# EasyEDA Pro project filmprocessor.epro

# Schematic github.com/wojas/filmprocessor
Board Name: Board1; Create Date: 2025-09-29; Page Name: P1; Project Name: Film Processor; Schematic Name: github.com/wojas/filmprocessor; Update Date: 2025-10-02; Page Size: A4; Version: V1.0
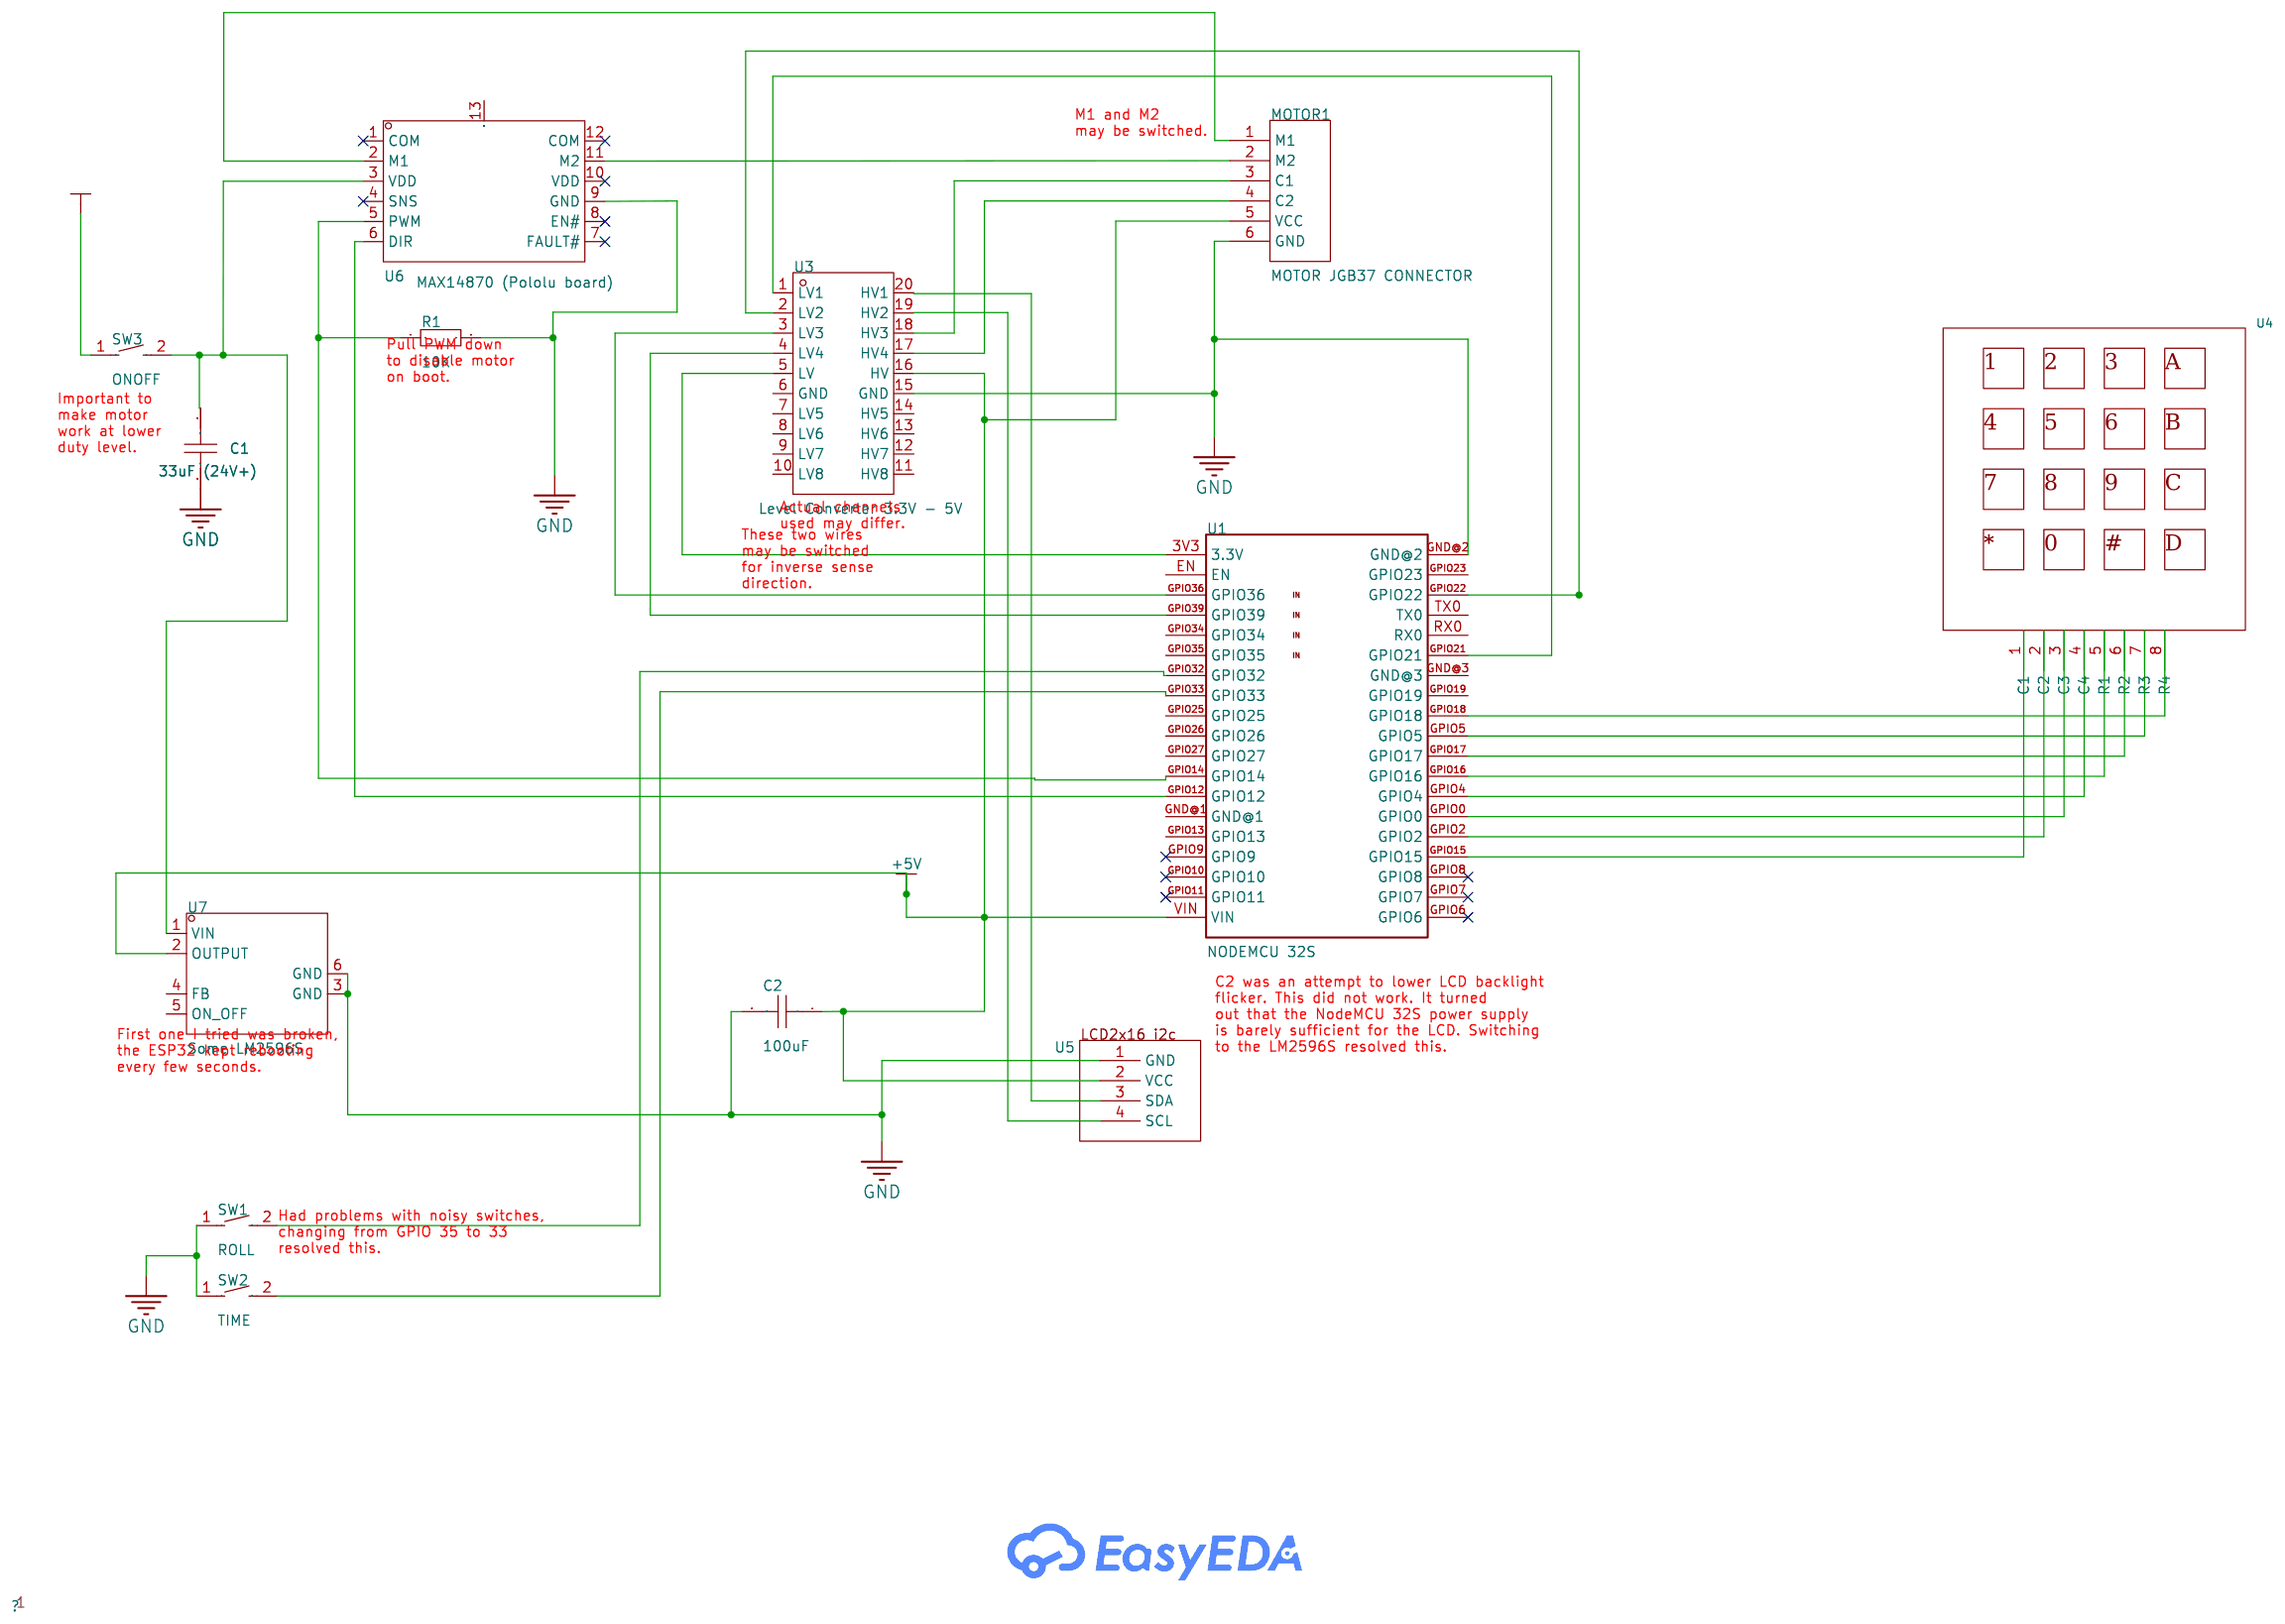
[diagram p0: schematic sheet]

## Parts
C1  33uF (24V+)  [C0603]
C2  100uF  [C0603]
MOTOR1  MOTOR JGB37 CONNECTOR
R1  10K  [R0603]
SW1  ROLL  [KEY-SMD_L6.0-W3.5-LS8.0]
SW2  TIME  [KEY-SMD_L6.0-W3.5-LS8.0]
SW3  ONOFF  [KEY-SMD_L6.0-W3.5-LS8.0]
U1  NODEMCU32S  [footprints:NODEMCU32S]
U3  Level Converter 3.3V - 5V  [MPN-TH-20_L28.0-W14.0-P2.54-BL]
U4  -
U5  -
U6  MAX14870 (Pololu board)  [DFN-12_L3.0-W3.0-P0.50-LS3.0-BL-EP]
U7  Some LM2596S  [TO-263-5_L10.4-W8.6-P1.70-LS15.3-BR]

## Library data of the parts
C1 C2 = CAP_0603: Supplier Footprint: 0603
MOTOR1 = MOTOR JGB37 CONNECTOR: Supplier Part: MOTOR JGB37-520
R1 = Res_0603: Supplier Footprint: 0603
SW1-SW3 = BUTTON2,KEY: Supplier Part: C9900020455; JLCPCB Part Class: Extended Part; Supplier: LCSC
U1 = NODEMCU32S_NODEMCU32S: Users: D27; availability: Not in stock; check_prices: https://www.snapeda.com/parts/NODEMCU-32S/AI-Thinker/view-part/?ref=eda; mf: AI-Thinker; mp: NODEMCU-32S; Package1: Package; price: None; snapeda_link: https://www.snapeda.com/parts/NODEMCU-32S/AI-Thinker/view-part/?ref=snap
U3 = Level Converter 8: Supplier Part: C2829587; Supplier Footprint: DIP-20; JLCPCB Part Class: Extended Part; Supplier: LCSC
U4 = keypad
U5 = lcd_2x16 with i2c module
U6 = MAX14870ETC+T: LCSC Part Name: 3A 有刷直流电机驱动芯片 36V; Supplier Part: C194048; Manufacturer: ADI(亚德诺)/MAXIM(美信); Supplier Footprint: DFN-12(3x3); JLCPCB Part Class: Extended Part; Datasheet: https://atta.szlcsc.com/upload/public/pdf/source/20180625/C194048_CE7F1CC1EFE295F679622D2E942E3352.pdf; Supplier: LCSC
U7 = LM2596S-ADJ_C3198435: Function:Step-down type Output Type:Adjustable Input Voltage:4.5V~40V Input Voltage:4.5V~40V Output Voltage:1.2V~37V Output Voltage:1.2V~37V Output Current:3A Switching Frequency:150kHz Switching Frequency:150kHz Operating Temperature:-40℃~+125℃@(TJ) Oper; LCSC Part Name: LM2596S-ADJ; Supplier Part: C3198435; Supplier Footprint: TO-263-5; Datasheet: https://atta.szlcsc.com/upload/public/pdf/source/20230921/2B96ED50C3BF1924A72365F91F431302.pdf; Supplier: LCSC; Function: Step-down type; Output Type: Adjustable; Input Voltage: 4.5V~40V; Output Voltage: 1.2V~37V; Output Current: 3A; Switching Frequency: 150kHz; Operating Temperature: -40℃~+125℃@(TJ); Synchronous Rectification: No; Number of Outputs: 1; Topology: Step-down; Switch tube (built-in/external): Built-in

## Nets
+5V: C2.1 MOTOR1.5(VCC) U1.VIN U3.16(HV) U5.2(VCC) U7.2(OUTPUT)
+24V: SW3.1
GND: C1.2 C2.2 MOTOR1.6(GND) R1.2 SW1.1 SW2.1 U1.GND@2 U3.15(GND) U5.1(GND) U6.9(GND) U7.3(GND) U7.6(GND)
Net-(C1-1): C1.1 SW3.2 U6.3(VDD) U7.1(VIN)
Net-(MOTOR1-1): MOTOR1.1(M1) U6.2(M1)
Net-(MOTOR1-2): MOTOR1.2(M2) U6.11(M2)
Net-(MOTOR1-3): MOTOR1.3(C1) U3.18(HV3)
Net-(MOTOR1-4): MOTOR1.4(C2) U3.17(HV4)
Net-(R1-1): R1.1 U1.GPIO14 U6.5(PWM)
Net-(SW1-2): SW1.2 U1.GPIO32
Net-(SW2-2): SW2.2 U1.GPIO33
Net-(U1-3V3): U1.3V3(3.3V) U3.5(LV)
Net-(U1-GPIO0): U1.GPIO0 U4.3(C3)
Net-(U1-GPIO2): U1.GPIO2 U4.2(C2)
Net-(U1-GPIO4): U1.GPIO4 U4.4(C4)
Net-(U1-GPIO5): U1.GPIO5 U4.7(R3)
Net-(U1-GPIO12): U1.GPIO12 U6.6(DIR)
Net-(U1-GPIO15): U1.GPIO15 U4.1(C1)
Net-(U1-GPIO16): U1.GPIO16 U4.5(R1)
Net-(U1-GPIO17): U1.GPIO17 U4.6(R2)
Net-(U1-GPIO18): U1.GPIO18 U4.8(R4)
Net-(U1-GPIO21): U1.GPIO21 U3.1(LV1)
Net-(U1-GPIO22): U1.GPIO22 U3.2(LV2)
Net-(U1-GPIO36): U1.GPIO36 U3.3(LV3)
Net-(U1-GPIO39): U1.GPIO39 U3.4(LV4)
Net-(U3-20): U3.20(HV1) U5.3(SDA)

Not connected (* = marked no-connect by the designer): U1 EN GND@1 GND@3 GPIO6* GPIO7* GPIO8* GPIO9* GPIO10* GPIO11* GPIO13 GPIO19 GPIO23 GPIO25 GPIO26 GPIO27 GPIO34 GPIO35 RX0 TX0; U3 6(GND) 7(LV5) 8(LV6) 9(LV7) 10(LV8) 11(HV8) 12(HV7) 13(HV6) 14(HV5) 19(HV2); U5 4(SCL); U6 1(COM)* 4(SNS)* 7(FAULT#)* 8(EN#)* 10(VDD)* 12(COM)* 13(PAD); U7 4(FB) 5(ON_OFF)

## Notes on the sheet
- M1 and M2
  may be switched.
- Pull PWM down
  to disable motor
  on boot.
- Important to
  make motor
  work at lower
  duty level.
- Actual channels
  used may differ.
- These two wires
  may be switched
  for inverse sense
  direction.
- First one I tried was broken,
  the ESP32 kept rebooting
  every few seconds.
- C2 was an attempt to lower LCD backlight
  flicker. This did not work. It turned
  out that the NodeMCU 32S power supply
  is barely sufficient for the LCD. Switching
  to the LM2596S resolved this.
- Had problems with noisy switches,
  changing from GPIO 35 to 33
  resolved this.
